# Altium schematic sheet power_supply.SchDoc
size A
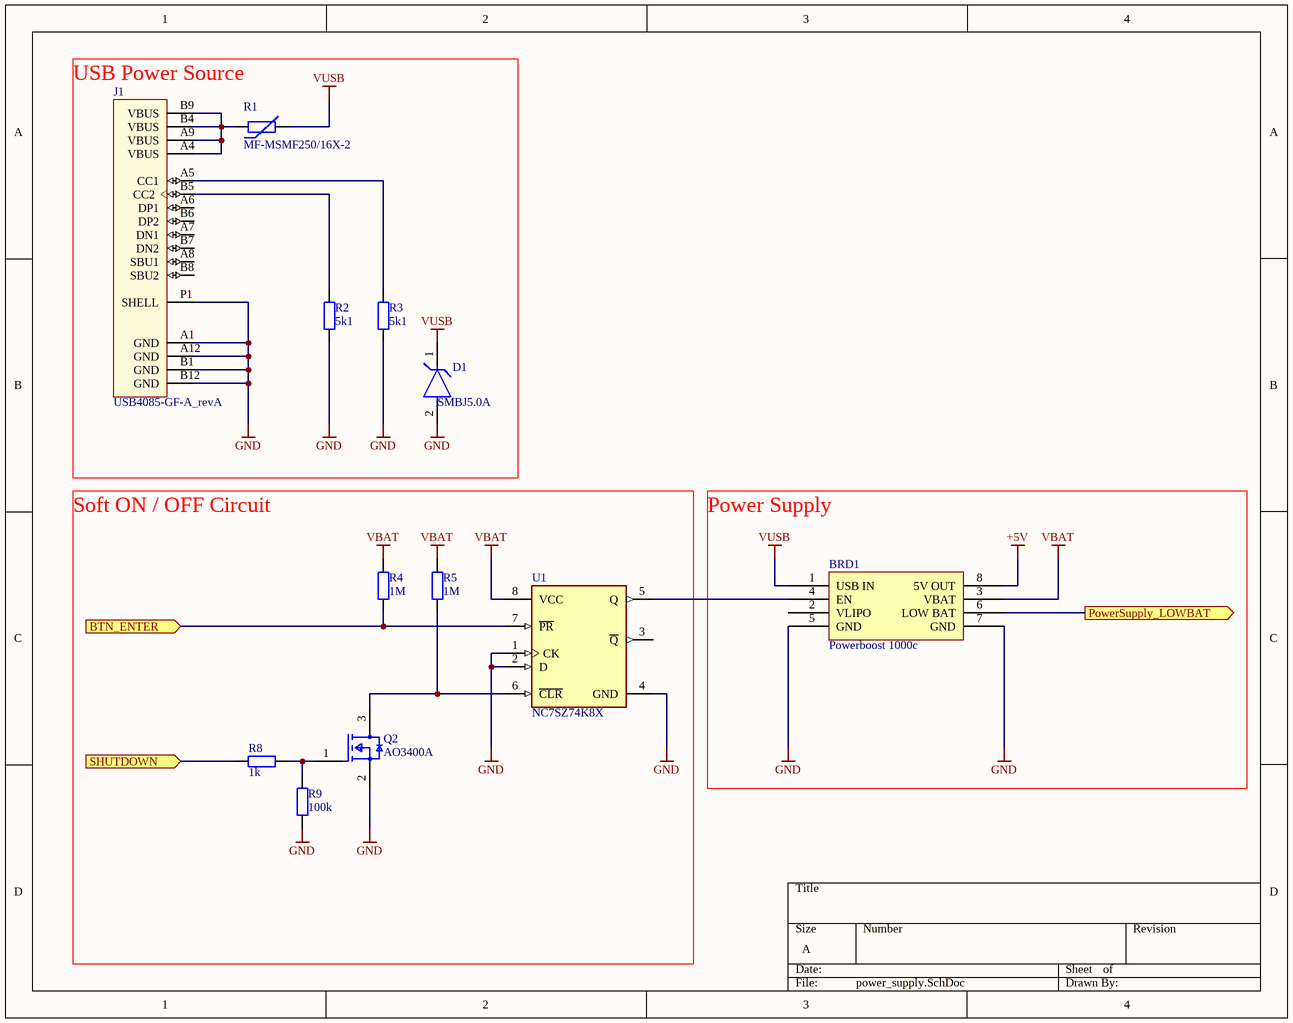
[diagram p0: power_supply.SchDoc]

## Parts
BRD1  Powerboost 1000c  [POWERBOOST_1000C]
D1  SMBJ5.0A  [FP-SMBJ-MFG]
J1  USB4085-GF-A_revA  [GCT_USB4085-GF-A_REVA]
Q2  AO3400A  [SOT23]
R1  MF-MSMF250/16X-2  [Res_1812]
R2  value 5k1  [RESC2013X50X30NL20T20]  (hidden comment: Res_0805)
R3  value 5k1  [RESC2013X50X30NL20T20]  (hidden comment: Res_0805)
R4  value 1M  [RESC2013X50X30NL20T20]  (hidden comment: Res_0805)
R5  value 1M  [RESC2013X50X30NL20T20]  (hidden comment: Res_0805)
R8  value 1k  [RESC2013X50X30NL20T20]  (hidden comment: Res_0805)
R9  value 100k  [RESC2013X50X30NL20T20]  (hidden comment: Res_0805)
U1  NC7SZ74K8X  [FP-846AN-MFG]

## Ports
BTN_ENTER (in), PowerSupply_LOWBAT (out), SHUTDOWN (in)

## Nets
+5V: BRD1.8(5V_OUT)
GND: BRD1.5(GND) BRD1.7(GND) D1.2(A) J1.A1(GND) J1.A12(GND) J1.B1(GND) J1.B12(GND) J1.P1(SHELL) Q2.2(S) R2.1 R3.1 R9.1 U1.1(CK) U1.2(D) U1.4(GND)
VBAT: BRD1.3(VBAT) R4.2 R5.2 U1.8(VCC)
VUSB: BRD1.1(USB_IN) D1.1(C) R1.2
BTN_ENTER: R4.1 U1.7(~{PR}) ; port BTN_ENTER
PowerSupply_LOWBAT: BRD1.6(LOW_BAT) ; port PowerSupply_LOWBAT
SHUTDOWN: R8.1 ; port SHUTDOWN
NetBRD1_4: BRD1.4(EN) U1.5(Q)
NetJ1_A4: J1.A4(VBUS) J1.A9(VBUS) J1.B4(VBUS) J1.B9(VBUS) R1.1
NetJ1_A5: J1.A5(CC1) R3.2
NetJ1_B5: J1.B5(CC2) R2.2
NetQ2_1: Q2.1(G) R8.2 R9.2
NetQ2_3: Q2.3(D) R5.1 U1.6(~{CLR})

Not connected (* = marked no-connect by the designer): BRD1 2(VLIPO); J1 A6(DP1) A7(DN1) A8(SBU1) B6(DP2) B7(DN2) B8(SBU2); U1 3(~{Q})

## Notes on the sheet
- USB Power Source
- (near BRD1) Power Supply
- Soft ON / OFF Circuit

## Library data of the parts
BRD1 = Powerboost_1000c: BOARD PWRBOOST1000 5V LIPO USB; Manufacturer: Adafruit Industries; Manufacturer Part Number: 2465; Evaluation Kit: Yes; Output Voltage: 5.2V; Output Current: 1A; Switching Frequency: 700kHz; Supplier 1: Digi-Key; RoHS: No; Category: Embedded Processors and Controllers; Stock 1: 834; Pricing 1: 1=19.95000 (USD); Package Quantity: 1; ComponentLink1URL: https://media.digikey.com/pdf/Data%20Sheets/Adafruit%20PDFs/2465_Web.pdf?src-supplier=Digi-Key; ComponentLink1Description: https://media.digikey.com/pdf/Data%20Sheets/Adafruit%20PDFs/2465_Web.pdf?src-supplier=Digi-Key; Supplier Part Number 1: 1528-1349-ND
D1 = CMP-08607-000042-1: TVS DIODE 5V 9.2V DO214AA; Manufacturer: Littelfuse Inc; Breakdown Voltage: 6.4V; Direction: Unidirectional; Peak Pulse Current: 65.3A; Max Junction Temp: +150°C; Number Of Channels: 1; Peak Pulse Power: 600W; Clamping Voltage: 9.2V; Octopart: https://octopart.com/smbj5.0a-littelfuse-8835; Package: SMBJ; RoHS: TRUE; Temperature Range Low: -65°C; Device Class L2: TVS Diodes; Automotive: No; ComponentLink2URL: https://www.littelfuse.com/~/media/electronics/datasheets/tvs_diodes/littelfuse_tvs_diode_smbj_datasheet.pdf.pdf; Height: 2.61mm; ComponentLink2Description: Datasheet; Temperature: -65°C to +150°C; Category: Diode; Temperature Range High: +150°C; Lead Free: Yes; Digikey Description: TVS DIODE 5V 9.2V DO214AA; Device Class L1: Circuit Protection; Reverse Standoff Voltage: 5V; Device Class L3: unset; Manufacturer Part Number: SMBJ5.0A; Mouser Description: TVSS; Diode; For Data/Comm; Industrial Equip; 65.3A; SMD; Solder Term; Clamp-V 9.2V
J1 = USB-C port: USB 2.0 Type C Receptacle Dip Type, PCB Top Mount; MANUFACTURER: Global Connector Technology; PARTREV: A; STANDARD: Manufacturer Recommendations
Q2 = MOSFET_AO3400A: MOSFET N-CH 30V 5.7A SOT23; Input Capacitance: 630pF; Number of Elements: 1; Rds On Max: 26.5mR; Max Power Dissipation: 1.4W; Gate to Source Voltage (Vgs): 12V; Min Operating Temperature: -55°C; Lead Free: Lead Free; Number of Pins: 3; Drain to Source Voltage (Vdss): 30V; Case/Package: SOT-23; Mount: Surface Mount; Continuous Drain Current (ID): 5.7A; Radiation Hardening: No; Packaging: Tape and Reel; Max Operating Temperature: 150°C; Power Dissipation: 1.4W
R1 = PTC Fuse: PTC Resettable Fuse 2.5A(hold) 5A(trip) 16V 100A 1.2W 5s 0.015Ohm SMD Solder Pad 1812 T/R; Manufacturer: Bourns; Number of Terminals/Pins: 2; Resistance: 100mR; Approvals: UL,CSA,TUV; Supplier 1: Digi-Key; RoHS: Yes; Category: Fuses; Stock 1: 33109; Pricing 1: 1=0.54000, 5=0.52000, 10=0.50400, 50=0.42400, 100=0.35200, 250=0.32000, 500=0.27200 (USD); Mount: Surface Mount,PCB; Case/Package: 1812; Case Code (Imperial): 1812; Case Code (Metric): 4532; Contact Plating: Gold; Min Operating Temperature: -40°C; Max Operating Temperature: 85°C; Hold Current: 2.5A; Trip Current: 5A; Max Current Rating: 100A; Power Dissipation: 1.2W; Current Rating: 100A; Time to Trip: 5s; Package Quantity: 1500; Packaging: Tape and Reel; Voltage Rating: 16V; Voltage Rating (DC): 16V; Termination: SMD/SMT; Length: 4.73mm; Width: 3.41mm; Height: 1.6mm; Radiation Hardening: No; REACH SVHC: No SVHC; ComponentLink1URL: https://datasheet.ciiva.com/3020/mfmsmf-3020420.pdf?src-supplier=Avnet; ComponentLink1Description: https://datasheet.ciiva.com/3020/mfmsmf-3020420.pdf?src-supplier=Avnet; ComponentLink2URL: https://datasheet.ciiva.com/16206/mfmsmf-16206071.pdf?src-supplier=Onlinecomponents.com; ComponentLink2Description: https://datasheet.ciiva.com/16206/mfmsmf-16206071.pdf?src-supplier=Onlinecomponents.com; ComponentLink3URL: https://datasheet.ciiva.com/7434/mfmsmf-7434296.pdf?src-supplier=Digi-Key; ComponentLink3Description: https://datasheet.ciiva.com/7434/mfmsmf-7434296.pdf?src-supplier=Digi-Key; ComponentLink4URL: https://datasheet.ciiva.com/32430/mf-msmf-series-eng-tds-32430600.pdf?src-supplier=Distrelec; ComponentLink4Description: https://datasheet.ciiva.com/32430/mf-msmf-series-eng-tds-32430600.pdf?src-supplier=Distrelec; ComponentLink5URL: https://datasheet.ciiva.com/7434/mfmsmf-7434298.pdf?src-supplier=Digi-Key; ComponentLink5Description: https://datasheet.ciiva.com/7434/mfmsmf-7434298.pdf?src-supplier=Digi-Key; ComponentLink6URL: https://datasheet.ciiva.com/16692/mfmsmf-16692202.pdf?src-supplier=Avnet+Europe; ComponentLink6Description: https://datasheet.ciiva.com/16692/mfmsmf-16692202.pdf?src-supplier=Avnet+Europe; ComponentLink7URL: https://datasheet.ciiva.com/30088/575mfmsmf-30088346.pdf?src-supplier=Onlinecomponents.com; ComponentLink7Description: https://datasheet.ciiva.com/30088/575mfmsmf-30088346.pdf?src-supplier=Onlinecomponents.com; ComponentLink8URL: https://datasheet.ciiva.com/7434/mfmsmf-7434299.pdf?src-supplier=Digi-Key; ComponentLink8Description: https://datasheet.ciiva.com/7434/mfmsmf-7434299.pdf?src-supplier=Digi-Key; ComponentLink9URL: https://datasheet.ciiva.com/14538/70153434-14538955.pdf?src-supplier=Allied+Electronics; ComponentLink9Description: https://datasheet.ciiva.com/14538/70153434-14538955.pdf?src-supplier=Allied+Electronics; ComponentLink10URL: https://datasheet.ciiva.com/8005/1786007-8005325.pdf?src-supplier=Element14; ComponentLink10Description: https://datasheet.ciiva.com/8005/1786007-8005325.pdf?src-supplier=Element14; ComponentLink11URL: https://datasheet.ciiva.com/48700/001055646-da-01-en-sich-ptc-reset-mf-msmf250-16x-2-2-5a16v-48700197.pdf?src-supplier=Conrad; ComponentLink11Description: https://datasheet.ciiva.com/48700/001055646-da-01-en-sich-ptc-reset-mf-msmf250-16x-2-2-5a16v-48700197.pdf?src-supplier=Conrad; Supplier Part Number 1: MF-MSMF250/16X-2CT-ND; Manufacturer Part Number: MF-MSMF250/16X-2
R2-R5 R8 R9 = Res_0805: Resistor; Tolerance: 1%; Power Rating: 125mW
U1 = CMP-07113-000002-1: IC FF D-TYPE SNGL 1BIT US8; Manufacturer: ON Semiconductor; Frequency: 250MHz; Number Of Outputs: 2; Number Of Circuits: 1; Max Supply Voltage: 5.5V; Min Supply Voltage: 1.65V; Logic Function Desc: Non-inverting; Standoff Height: 0mm; Max Junction Temp: +150°C; Propagation Delay: 2.6ns; Quiescent Current: 1uA; Lead Free: Yes; Digikey Description: IC FF D-TYPE SNGL 1BIT US8; ComponentLink2Description: Datasheet; Temperature Range High: +150°C; Ambient Temperature Range Low: -40°C; Manufacturer Part Number: NC7SZ74K8X; Octopart: https://octopart.com/nc7sz74k8x-on+semiconductor-84330810; Ambient Temperature Range High: +85°C; Device Class L3: Latches and Flip Flops; ComponentLink2URL: https://www.onsemi.com/pub/Collateral/NC7SZ74-D.PDF; Device Class L1: Integrated Circuits (ICs); Mouser Description: Flip Flops TinyLogic UHS D-Type; Device Class L2: Logic ICs; Ipc Land Pattern Name: SOP50P200X90-8; Height: 0.9mm; RoHS: TRUE; Category: IC; Temperature: to +150°C; Automotive: No; Number Of Inputs: 1; Package: 846AN; Footprint Url: https://www.onsemi.com/pub/Collateral/846AN.PDF